# Altium schematic sheet USBHeaders.SchDoc
size A
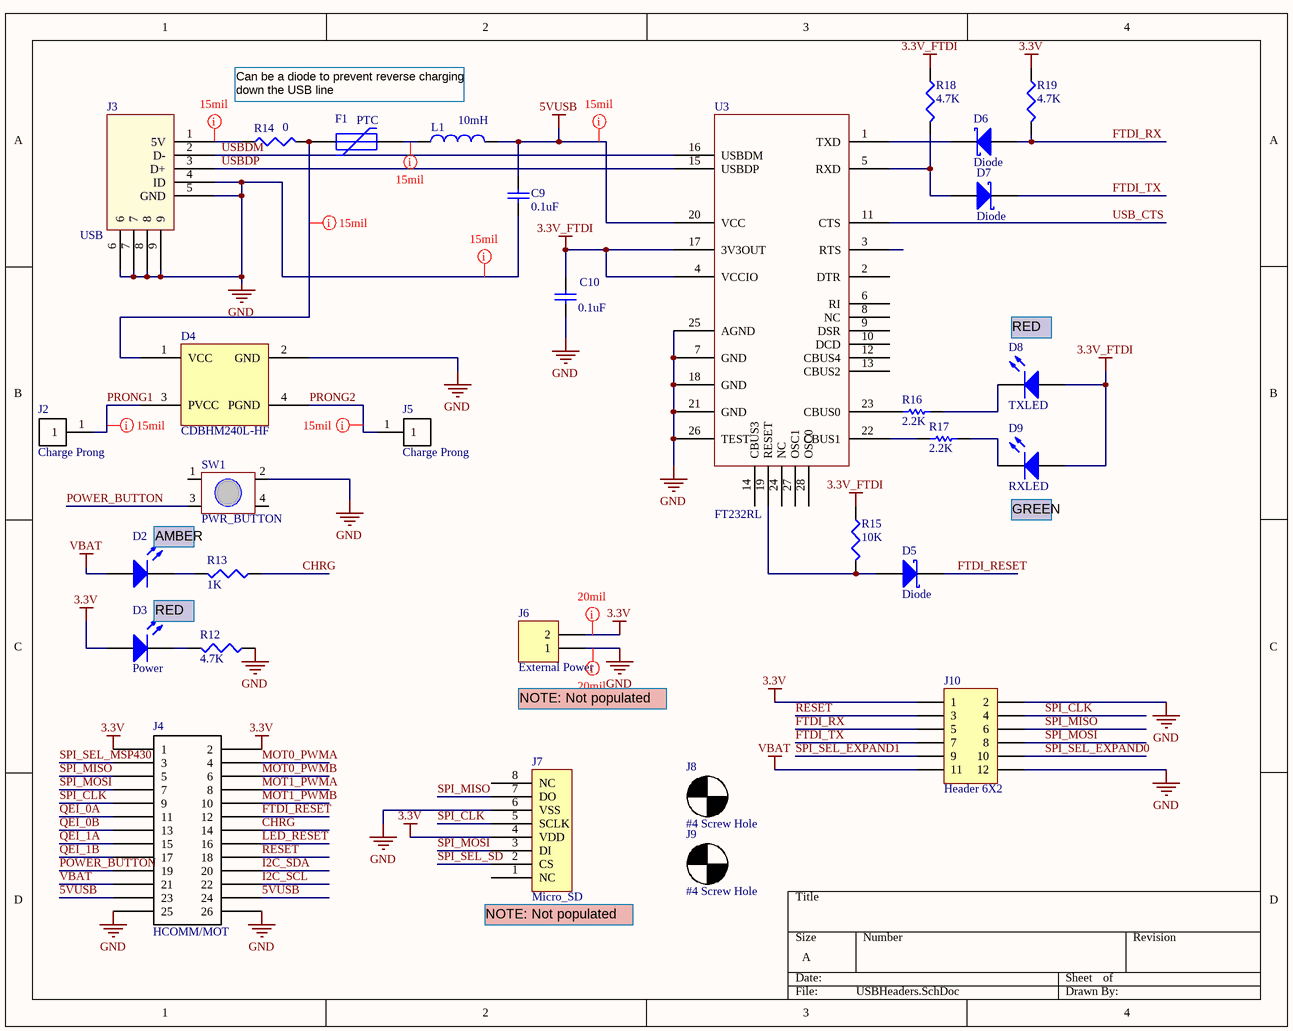
[diagram p0: USBHeaders.SchDoc]

## Parts
C9  value 0.1uF  [CAPC1005L]
C10  value 0.1uF  [CAPC1005L]
D2  Charge  [SurfaceMount(603)]  (value not drawn)
D3  Power  [SurfaceMount(603)]
D4  CDBHM240L-HF  [DIODEARRAY_2AMPS]
D5  Diode  [SurfaceMount(603)]
D6  Diode  [SurfaceMount(603)]
D7  Diode  [SurfaceMount(603)]
D8  TXLED  [SurfaceMount(603)]
D9  RXLED  [SurfaceMount(603)]
F1  PTC  [ERJ8G-1206]
J2  Charge Prong  [CHARGING_PRONG]
J3  USB  [USB Minib (thru-hole)]
J4  HCOMM/MOT  [HeaderSM 13x2]
J5  Charge Prong  [CHARGING_PRONG]
J6  External Power  [HDR1X2]
J7  Micro_SD  [MICRO_SD]
J8  #4 Screw Hole  [#4_Screw_Hole]
J9  #4 Screw Hole  [#4_Screw_Hole]
J10  Header 6X2  [HDR2X6]
L1  value 10mH  [INDC2012L]  (hidden comment: Inductor)
R12  value 4.7K  [RESC1608L]  (hidden comment: Res3)
R13  value 1K  [RESC1608L]  (hidden comment: Res3)
R14  value 0  [RESC1608L]  (hidden comment: Res3)
R15  value 10K  [RESC1608L]  (hidden comment: Res3)
R16  value 2.2K  [RESC1608L]
R17  value 2.2K  [RESC1608L]
R18  value 4.7K  [RESC1608L]  (hidden comment: Res3)
R19  value 4.7K  [RESC1608L]  (hidden comment: Res3)
SW1  PWR_BUTTON  [SwitchTall-TL330]
U3  FT232RL  [SSOP-28]

## Nets
3.3V: D3.1(A) J4.1 J4.2 J6.2 J7.4(VDD) J10.1 R19.1
3.3V_FTDI: C10.2 D8.1(A) D9.1(A) R15.1 R18.1 U3.4(VCCIO) U3.17(3V3OUT)
5VUSB: C9.2 J4.23 J4.24 L1.2 U3.20(VCC)
GND: C9.1 C10.1 D4.2(GND) J3.4(ID) J3.5(GND) J3.6 J3.7 J3.8 J3.9 J4.25 J4.26 J6.1 J7.6(VSS) J10.2 J10.12 R12.1 SW1.2 U3.7(GND) U3.18(GND) U3.21(GND) U3.25(AGND) U3.26(TEST)
VBAT: D2.1(A) J4.21 J10.11
CHRG: J4.14 R13.1
FTDI_RESET: D5.1(K) J4.12
FTDI_RX: D6.2(A) J10.5 R19.2
FTDI_TX: D7.1(K) J10.7
I2C_SCL: J4.22
I2C_SDA: J4.20
LED_RESET: J4.16
MOT0_PWMA: J4.4
MOT0_PWMB: J4.6
MOT1_PWMA: J4.8
MOT1_PWMB: J4.10
POWER_BUTTON: J4.19 SW1.3
PRONG1: D4.3(PVCC) J2.1
PRONG2: D4.4(PGND) J5.1
QEI_0A: J4.11
QEI_0B: J4.13
QEI_1A: J4.15
QEI_1B: J4.17
RESET: J4.18 J10.3
SPI_CLK: J4.9 J7.5(SCLK) J10.4
SPI_MISO: J4.5 J7.7(DO) J10.6
SPI_MOSI: J4.7 J7.3(DI) J10.8
SPI_SEL_EXPAND0: J10.10
SPI_SEL_EXPAND1: J10.9
SPI_SEL_MSP430: J4.3
SPI_SEL_SD: J7.2(CS)
USB_CTS: U3.11(CTS)
USBDM: J3.2(D-) U3.16(USBDM)
USBDP: J3.3(D+) U3.15(USBDP)
NetD2_2: D2.2(K) R13.2
NetD3_2: D3.2(K) R12.2
NetD4_1: D4.1(VCC) F1.2 R14.2
NetD5_2: D5.2(A) R15.2 U3.19(RESET)
NetD6_1: D6.1(K) U3.1(TXD)
NetD7_2: D7.2(A) R18.2 U3.5(RXD)
NetD8_2: D8.2(K) R16.2
NetD9_2: D9.2(K) R17.2
NetF1_1: F1.1 L1.1
NetJ3_1: J3.1(5V) R14.1
NetR16_1: R16.1 U3.23(CBUS0)
NetR17_1: R17.1 U3.22(CBUS1)

Not connected (* = marked no-connect by the designer): J7 1(NC) 8(NC); SW1 1 4; U3 2(DTR) 3(RTS) 6(RI) 8(NC) 9(DSR) 10(DCD) 12(CBUS4) 13(CBUS2) 14(CBUS3) 24(NC) 27(OSC1) 28(OSC0)

## Layout directives
rule Width Constraint [Pref Width = 15mil    Min Width = 8mil    Max Width = 30mil]: 3.3V
rule Width Constraint [Pref Width = 8mil    Min Width = 8mil    Max Width = 15mil]: 5VUSB, GND, NetJ3_1
rule Width Constraint [Pref Width = 15mil    Min Width = 15mil    Max Width = 20mil]: NetD4_1, NetF1_1
rule Width Constraint [Pref Width = 15mil    Min Width = 8mil    Max Width = 20mil]: PRONG1, PRONG2
rule Width Constraint [Pref Width = 15mil    Min Width = 8mil    Max Width = 100mil]: GND

## Notes on the sheet
- Can be a diode to prevent reverse charging down the USB line
- (near D8) RED
- (near D9) GREEN
- AMBER
- RED
- (near J6) NOTE: Not populated
- (near J7) NOTE: Not populated

## Library data of the parts
C9 C10 = Cap: Capacitor; Published: 8-Jun-2000; LatestRevisionDate: 17-Jul-2002; LatestRevisionNote: Re-released for DXP Platform.; PackageReference: RAD-0.3; Publisher: Altium Limited
D2 D8 D9 = LED2: Typical RED, GREEN, YELLOW, AMBER GaAs LED; Published: 8-Jun-2000; LatestRevisionDate: 17-Jul-2002; LatestRevisionNote: Re-released for DXP Platform.; PackageVersion: Feb-2002; PackageReference: 3.2X1.6X1.1; Publisher: Altium Limited
D3 = LED
D4 = DiodeArray2Amps: MPN: CDBHM240L-HF
D5-D7 = SchottkeyDiode
F1 = PTC_FUSE: Fuse; Published: 8-Jun-2000; LatestRevisionDate: 17-Jul-2002; LatestRevisionNote: Re-released for DXP Platform.; PackageReference: PIN-W2/E2.8; Publisher: Altium Limited
J2 J5 = CHARGE_PRONG: Charging Prong Hole with Plating
J3 = USB-ConnTH
J4 = HCOMM/HMOT: Header, 2X20, 50mil, IDC
J6 = Header 2: Header, 2-Pin; LatestRevisionDate: 17-Jul-2002; LatestRevisionNote: Re-released for DXP Platform.; Publisher: Altium Limited
J8 J9 = Mechanical_Hole: A mechanical hole for mounting the board
J10 = Header 6X2: Header, 6-Pin, Dual row; LatestRevisionDate: 17-Jul-2002; LatestRevisionNote: Re-released for DXP Platform.; Publisher: Altium Limited
L1 = Inductor: Code_IEC: 1005; Published: 8-Jun-2000; LatestRevisionDate: 29-May-2009; LatestRevisionNote: IPC-7351 Footprint Added.; PackageReference: 0402-A; Publisher: Altium Limited; PackageDescription: Chip Inductor; Code_JEITA: 0402
R12-R15 R18 R19 = Res3: Resistor; Published: 8-Jun-2000; LatestRevisionDate: 29-May-2009; LatestRevisionNote: IPC-7351 Footprint Added.; PackageReference: J1-0603; Publisher: Altium Limited; PackageDescription: Chip Resistor
R16 R17 = Res1: Resistor; Published: 8-Jun-2000; LatestRevisionDate: 17-Jul-2002; LatestRevisionNote: Re-released for DXP Platform.; PackageReference: AXIAL-0.3; Publisher: Altium Limited
SW1 = Switch-TL330